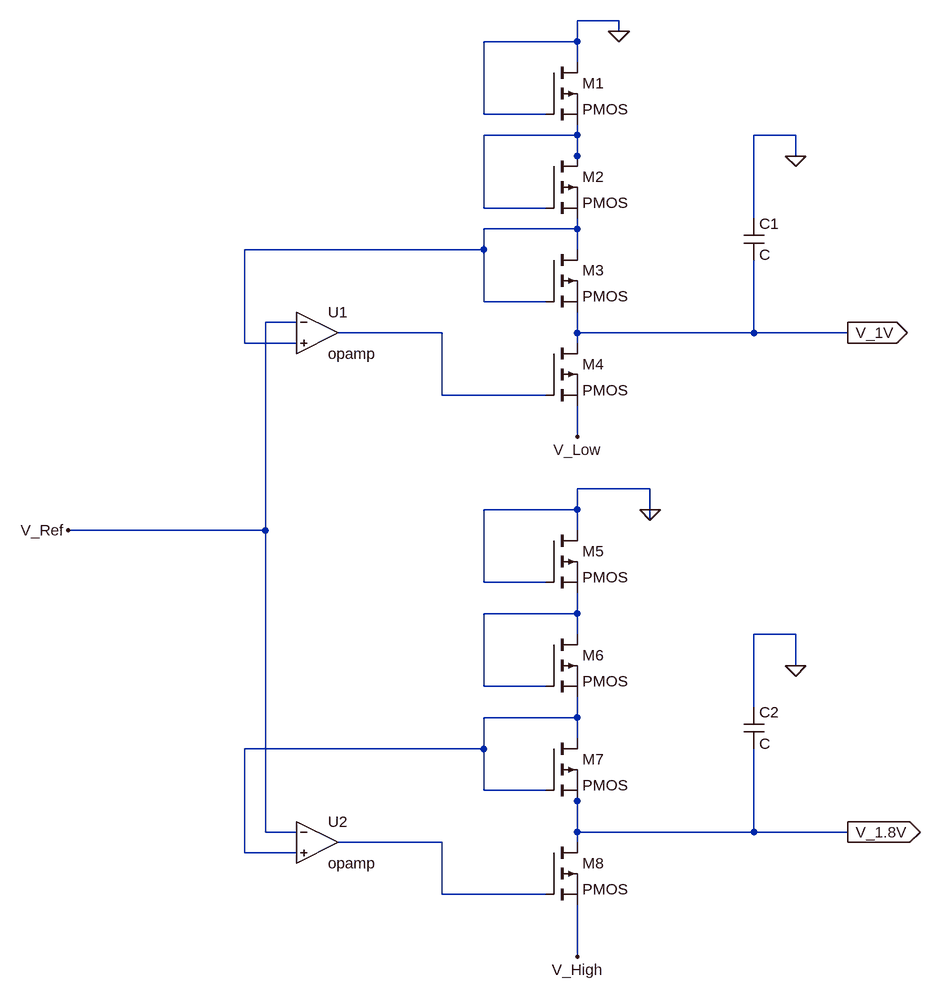
[diagram p0: schematic Voltage_Regulator.asc]
Voltage_Regulator.asc, the LTspice schematic file:
Version 4
SHEET 1 880 1616
WIRE -32 -176 -96 -176
WIRE -32 -160 -32 -176
WIRE -96 -144 -96 -176
WIRE -96 -144 -240 -144
WIRE -96 -112 -96 -144
WIRE -240 -32 -240 -144
WIRE -144 -32 -240 -32
WIRE -96 0 -96 -16
WIRE -96 0 -240 0
WIRE 240 0 176 0
WIRE -96 32 -96 0
WIRE 240 32 240 0
WIRE -96 48 -96 32
WIRE -240 112 -240 0
WIRE -144 112 -240 112
WIRE 176 128 176 0
WIRE -96 144 -96 128
WIRE -96 144 -240 144
WIRE -240 176 -240 144
WIRE -240 176 -608 176
WIRE -96 176 -96 144
WIRE -240 256 -240 176
WIRE -144 256 -240 256
WIRE -528 288 -576 288
WIRE -304 304 -464 304
WIRE -96 304 -96 272
WIRE 176 304 176 192
WIRE 176 304 -96 304
WIRE 320 304 176 304
WIRE -608 320 -608 176
WIRE -528 320 -608 320
WIRE -96 320 -96 304
WIRE -304 400 -304 304
WIRE -144 400 -304 400
WIRE -96 464 -96 416
WIRE 16 544 -96 544
WIRE -96 576 -96 544
WIRE -96 576 -240 576
WIRE 16 576 16 544
WIRE 16 592 16 576
WIRE -576 608 -576 288
WIRE -576 608 -880 608
WIRE -96 608 -96 576
WIRE -240 688 -240 576
WIRE -144 688 -240 688
WIRE -96 736 -96 704
WIRE -96 736 -240 736
WIRE -96 768 -96 736
WIRE 240 768 176 768
WIRE 240 816 240 768
WIRE -240 848 -240 736
WIRE -144 848 -240 848
WIRE 176 880 176 768
WIRE -96 896 -96 864
WIRE -96 896 -240 896
WIRE -96 928 -96 896
WIRE -240 944 -240 896
WIRE -240 944 -608 944
WIRE -240 1008 -240 944
WIRE -144 1008 -240 1008
WIRE -96 1024 -96 1008
WIRE -576 1072 -576 608
WIRE -528 1072 -576 1072
WIRE -96 1072 -96 1024
WIRE 176 1072 176 944
WIRE 176 1072 -96 1072
WIRE 320 1072 176 1072
WIRE -304 1088 -464 1088
WIRE -96 1088 -96 1072
WIRE -608 1104 -608 944
WIRE -528 1104 -608 1104
WIRE -304 1168 -304 1088
WIRE -144 1168 -304 1168
WIRE -96 1264 -96 1184
FLAG -32 -160 0
FLAG 240 32 0
FLAG 16 576 0
FLAG 240 816 0
FLAG -96 1264 V_High
FLAG -96 464 V_Low
FLAG -880 608 V_Ref
FLAG 320 1072 V_1.8V
IOPIN 320 1072 Out
FLAG 320 304 V_1V
IOPIN 320 304 Out
SYMBOL pmos -144 -112 R0
SYMATTR InstName M1
SYMBOL pmos -144 32 R0
SYMATTR InstName M2
SYMBOL pmos -144 176 R0
SYMATTR InstName M3
SYMBOL pmos -144 320 R0
SYMATTR InstName M4
SYMBOL cap 160 128 R0
SYMATTR InstName C1
SYMBOL Opamps\\opamp -496 240 R0
SYMATTR InstName U1
SYMBOL pmos -144 608 R0
SYMATTR InstName M5
SYMBOL pmos -144 768 R0
SYMATTR InstName M6
SYMBOL pmos -144 928 R0
SYMATTR InstName M7
SYMBOL pmos -144 1088 R0
SYMATTR InstName M8
SYMBOL Opamps\\opamp -496 1024 R0
SYMATTR InstName U2
SYMBOL cap 160 880 R0
SYMATTR InstName C2

The netlist it stands for:
* Voltage_Regulator.asc
M1 0 0 N001 N001 PMOS
M2 N001 N001 N002 N002 PMOS
M3 N002 N002 V_1V V_1V PMOS
M4 V_1V N003 V_Low V_Low PMOS
C1 0 V_1V C
XU1 V_Ref N002 N003 opamp Aol=100K GBW=10Meg  ; pins invin noninvin out
M5 0 0 N004 N004 PMOS
M6 N004 N004 N005 N005 PMOS
M7 N005 N005 V_1.8V V_1.8V PMOS
M8 V_1.8V N006 V_High V_High PMOS
XU2 V_Ref N005 N006 opamp Aol=100K GBW=10Meg  ; pins invin noninvin out
C2 0 V_1.8V C
.model NMOS NMOS
.model PMOS PMOS
.lib standard.mos
.backanno
.end